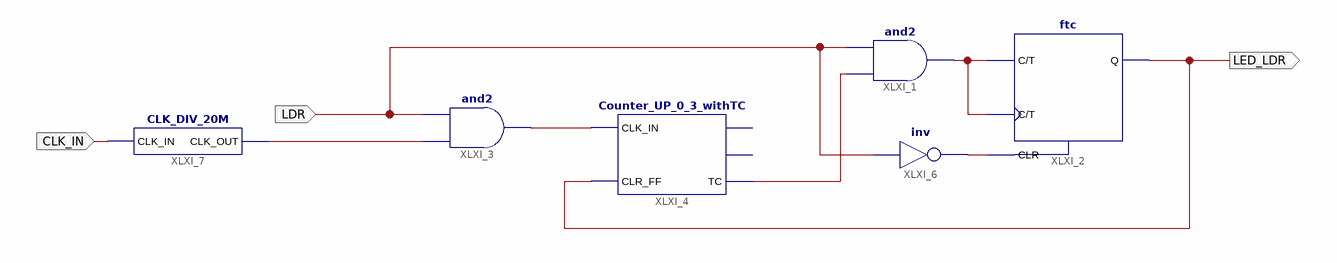
[diagram p0: schematic sheet 1]
// Xilinx ISE schematic LDR_LED_V2.sch (spartan6) as structural Verilog: 6 symbols, 3 ports
module LDR_LED_V2 (
  input  LDR,
  input  CLK_IN,
  output LED_LDR
);

  wire XLXN_2, XLXN_3, XLXN_17, XLXN_19, XLXN_20;

  and XLXI_1 (XLXN_19, XLXN_2, LDR);
  ftc XLXI_2 (.C(XLXN_19), .CLR(XLXN_17), .T(XLXN_19), .Q(LED_LDR));
  and XLXI_3 (XLXN_3, XLXN_20, LDR);
  Counter_UP_0_3_withTC XLXI_4 (.CLK_IN(XLXN_3), .CLR_FF(LED_LDR), .TC(XLXN_2));  // open: D0, D1
  not XLXI_6 (XLXN_17, LDR);
  CLK_DIV_20M XLXI_7 (.CLK_IN(CLK_IN), .CLK_OUT(XLXN_20));
endmodule
